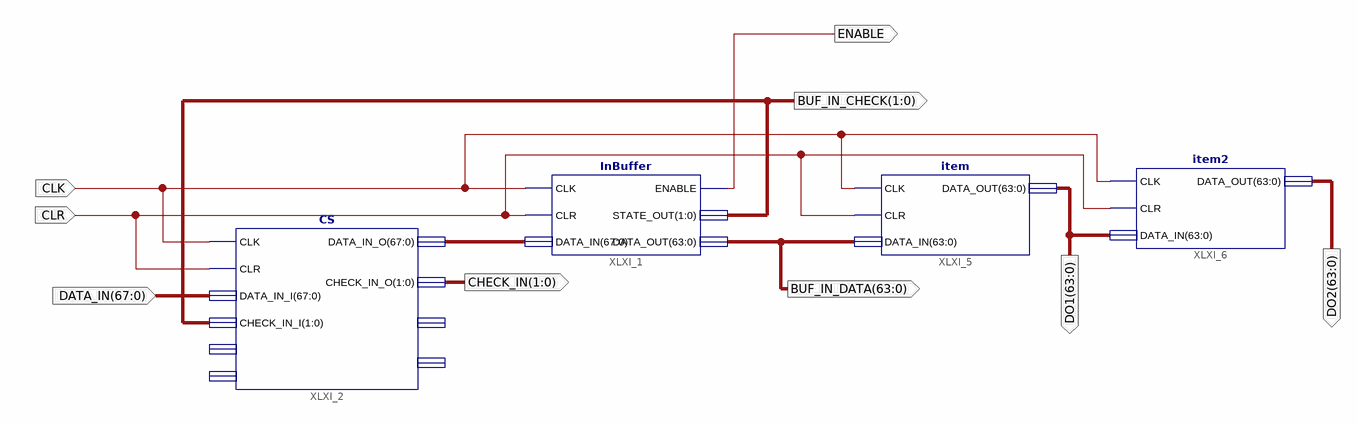
[diagram p0: schematic sheet 1]
// Xilinx ISE schematic top2.sch (spartan6) as structural Verilog: 4 symbols, 9 ports
module top2 (
  input  [67:0] DATA_IN,
  input  CLK,
  input  CLR,
  output [1:0] BUF_IN_CHECK,
  output [1:0] CHECK_IN,
  output [63:0] BUF_IN_DATA,
  output ENABLE,
  output [63:0] DO1,
  output [63:0] DO2
);

  wire [67:0] XLXN_9;

  InBuffer XLXI_1 (
    .CLK(CLK), .CLR(CLR), .DATA_IN(XLXN_9), .ENABLE(ENABLE), .STATE_OUT(BUF_IN_CHECK), .DATA_OUT(BUF_IN_DATA));
  CS XLXI_2 (
    .CLK(CLK), .CLR(CLR), .DATA_IN_I(DATA_IN), .CHECK_IN_I(BUF_IN_CHECK), .DATA_IN_O(XLXN_9),
    .CHECK_IN_O(CHECK_IN));  // open: DATA_OUT_I, CHECK_OUT_I, DATA_OUT_O, CHECK_OUT_O
  item XLXI_5 (.CLK(CLK), .CLR(CLR), .DATA_IN(BUF_IN_DATA), .DATA_OUT(DO1));
  item2 XLXI_6 (.CLK(CLK), .CLR(CLR), .DATA_IN(DO1), .DATA_OUT(DO2));
endmodule
